# Altium schematic sheet 08-LogicNAND.SchDoc
size A4
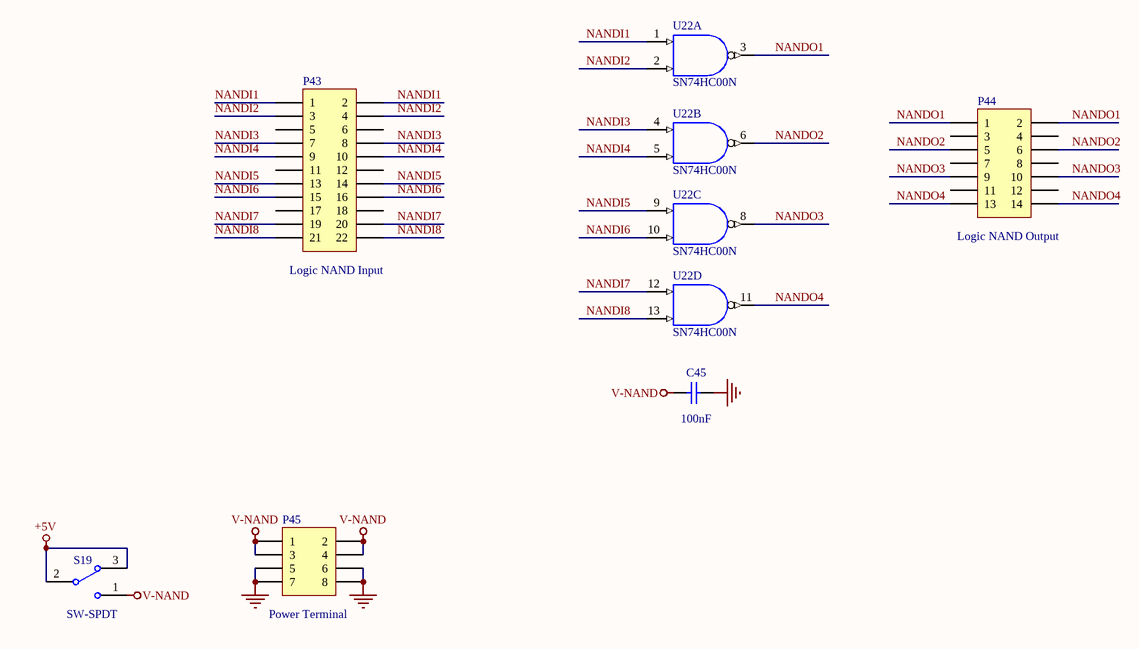
[diagram p0: 08-LogicNAND.SchDoc]

## Parts
C45  value 100nF  [C-0805]  (hidden comment: 104)
P43  value Logic NAND Input  [HDR2X11]  (hidden comment: Header 11X2)
P44  value Logic NAND Output  [HDR2X7]  (hidden comment: H7X2)
P45  Publisher: Power Terminal  [HDR2X4]  (hidden comment: Header 4X2)
S19  SW-SPDT  [SW-DIP1SMD]
U22  SN74HC00N  [SK-DIP14-300]  (parts A,B,C,D of 4)

## Nets
+5V: S19.2 S19.3
GND: C45.2 P45.5 P45.6 P45.7 P45.8 U22.7(GND)
V-NAND: C45.1 P45.1 P45.2 P45.3 P45.4 S19.1
VCC: U22.14(V-NAND)
NANDI1: P43.1 P43.2 U22.1(A)
NANDI2: P43.3 P43.4 U22.2(B)
NANDI3: P43.7 P43.8 U22.4(A)
NANDI4: P43.9 P43.10 U22.5(B)
NANDI5: P43.13 P43.14 U22.9(A)
NANDI6: P43.15 P43.16 U22.10(B)
NANDI7: P43.19 P43.20 U22.12(A)
NANDI8: P43.21 P43.22 U22.13(B)
NANDO1: P44.1 P44.2 U22.3(Y)
NANDO2: P44.5 P44.6 U22.6(Y)
NANDO3: P44.9 P44.10 U22.8(Y)
NANDO4: P44.13 P44.14 U22.11(Y)

Not connected (* = marked no-connect by the designer): P43 5 6 11 12 17 18; P44 3 4 7 8 11 12

## Library data of the parts
C45 = Cap: Capacitor; Published: 8-Jun-2000; LatestRevisionDate: 17-Jul-2002; LatestRevisionNote: Re-released for DXP Platform.; PackageReference: RAD-0.3; Publisher: Altium Limited; PackageDescription: Radial Cap, Thru-Hole; 2 Leads; 0.3 in Pin Spacing
P43 = Header 11X2: Header, 11-Pin, Dual row; LatestRevisionDate: 17-Jul-2002; LatestRevisionNote: Re-released for DXP Platform.
P44 = Header 7X2: Header, 7-Pin, Dual row; LatestRevisionDate: 17-Jul-2002; LatestRevisionNote: Re-released for DXP Platform.
P45 = Header 4X2: Header, 4-Pin, Dual row; LatestRevisionDate: 17-Jul-2002; LatestRevisionNote: Re-released for DXP Platform.
S19 = SW-SPDT: SPDT Subminiature Toggle Switch, Right Angle Mounting, Vertical Actuation; Published: 24-Mar-1999; LatestRevisionDate: 17-Dec-2003; LatestRevisionNote: Schematic revised, PCB Footprint replaced.; DatasheetVersion: 05-Dec-2000; PackageReference: TL36WW15050; Publisher: Altium Limited; PackageDescription: Switch; 4 Leads; ComponentLink1Description: Manufacturer Link; ComponentLink1URL: http://www.apem.com
U22 = SN74HC00N: Quadruple 2-Input Positive-NAND Gate; Published: 8-Jun-2000; LatestRevisionDate: 04-Mar-2005; LatestRevisionNote: Stylized 3D Model Added.; DatasheetVersion: May-1997; PackageVersion: Oct-1995; PackageReference: N014; Publisher: Altium Limited; PackageDescription: DIP; 14 Leads; Row Spacing 7.62 mm; Pitch 2.54 mm; ComponentLink1Description: Manufacturer Link; ComponentLink1URL: http://www.ti.com/; ComponentLink2Description: Datasheet; ComponentLink2URL: http://www-s.ti.com/sc/ds/sn74hc00.pdf